# EAGLE design LCDShieldC144MVGI 1.0 (EAGLE 5.11)

## Sheet 1 of 2
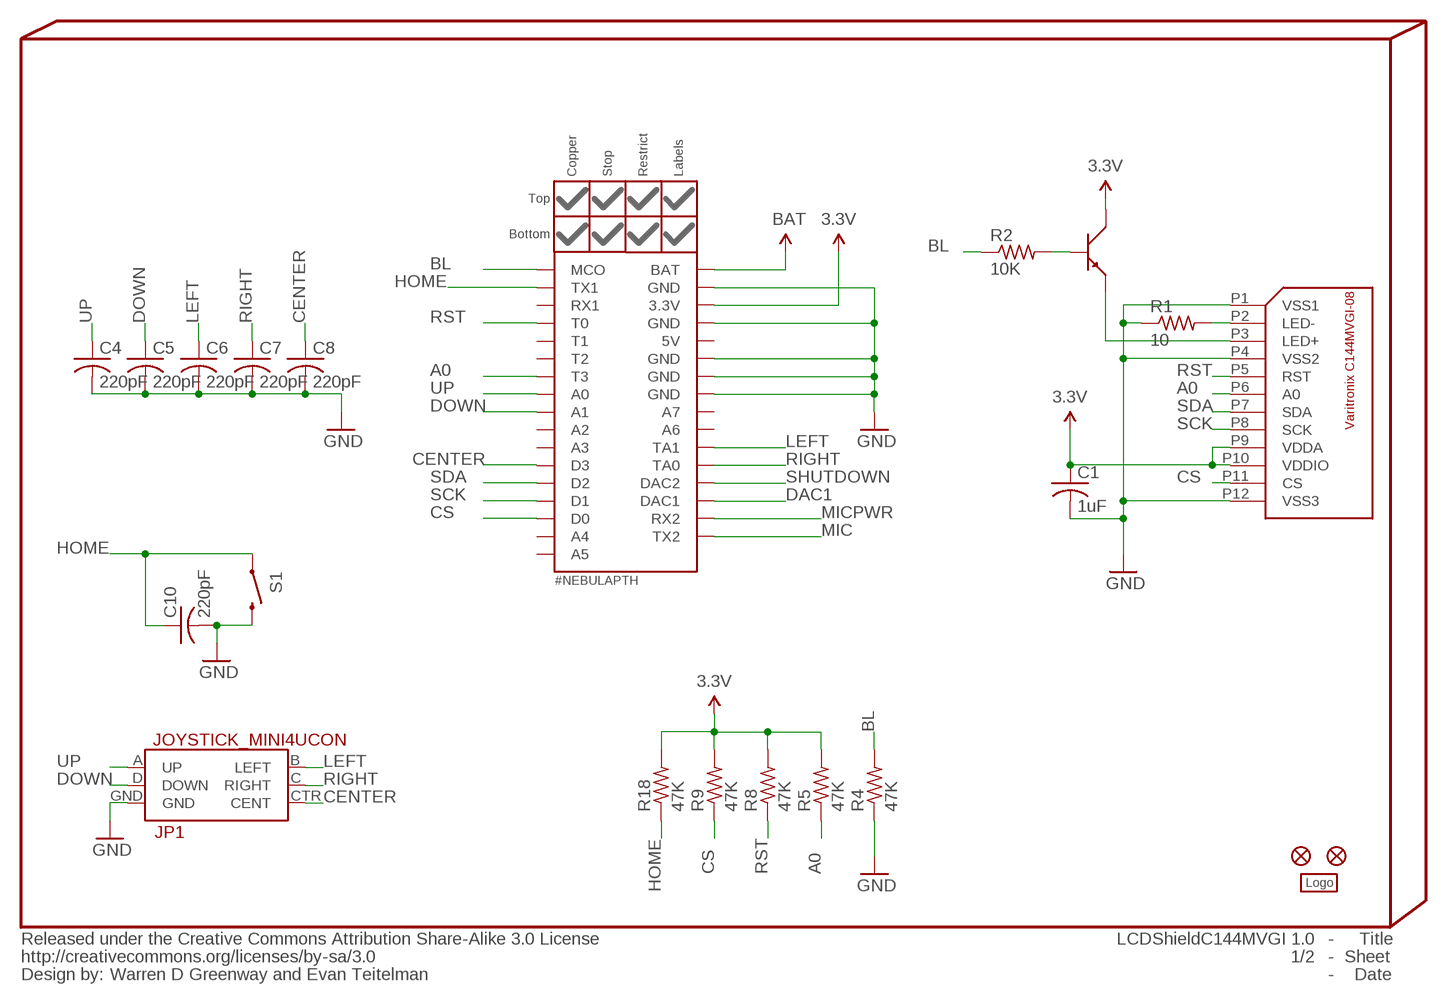
[diagram p0: schematic, sheet 1]

### Parts
C1  1uF  C-USC0402  [C0402]
C4  220pF  C-USC0402  [C0402]
C5  220pF  C-USC0402  [C0402]
C6  220pF  C-USC0402  [C0402]
C7  220pF  C-USC0402  [C0402]
C8  220pF  C-USC0402  [C0402]
C10  220pF  C-USC0402  [C0402]
INFO3  Warren D Greenway and Evan Teitelman  %CC-BY-SA  [%CC-BY-SA]
JP1  JOYSTICK_MINI4UCON  [JOYSTICK_MINI]
JP2  FIDUCIAL1X2.5  [FIDUCIAL-1X2.5]
JP3  FIDUCIAL1X2.5  [FIDUCIAL-1X2.5]
LOGO1  #PYGMYLOGOLARGE  [#PYGMYLOGO]
NEBULA1  #NEBULAPTH  [#NEBULA-PTH]
R1  10  R-US_R0805  [R0805]
R2  10K  R-US_R0402  [R0402]
R4  47K  R-US_R0402  [R0402]
R5  47K  R-US_R0402  [R0402]
R8  47K  R-US_R0402  [R0402]
R9  47K  R-US_R0402  [R0402]
R18  47K  R-US_R0402  [R0402]
S1  SWITCH-MOMENTARY-2SMD  [SPARKFUN_TACTILE_SWITCH_SMD]
U2  BIPOLAR-PMBT6428  [DUBLIB_SOT23]
U$1  VARITRONIX_COG-C144MVGI-08FOLDED  [VARITRONIX_COG-C144MVGI-08_FOLDED]

### Nets
3.3V: C1.1 NEBULA1.3.3V R5.2 R8.2 R9.2 R18.2 U2.3 U$1.P9(VDDA) U$1.P10(VDDIO) ; supply symbol labelled @3.3V ; also sheet 2
A0: NEBULA1.T3 R5.1 U$1.P6(A0)
BAT: NEBULA1.BAT ; supply symbol labelled @BAT ; also sheet 2
BL: NEBULA1.MCO R2.1 R4.2
CENTER: C8.1 JP1.CTR(CENT) NEBULA1.D3
CS: NEBULA1.D0 R9.1 U$1.P11(CS)
DAC1: NEBULA1.DAC1 ; also sheet 2
DOWN: C5.1 JP1.D(DOWN) NEBULA1.A1
GND: C1.2 C4.2 C5.2 C6.2 C7.2 C8.2 C10.2 JP1.GND NEBULA1.GND1(GND) NEBULA1.GND2(GND) NEBULA1.GND3(GND) NEBULA1.GND4(GND) NEBULA1.GND5(GND) R1.1 R4.1 S1.3 U$1.P1(VSS1) U$1.P4(VSS2) U$1.P12(VSS3) ; supply symbol labelled @GND ; also sheet 2
HOME: C10.1 NEBULA1.COM1_TX(TX1) R18.1 S1.1
LEFT: C6.1 JP1.B(LEFT) NEBULA1.TA1
MIC: NEBULA1.COM2_TX(TX2) ; also sheet 2
MICPWR: NEBULA1.COM2_RX(RX2) ; also sheet 2
N$5: R1.2 U$1.P2(LED-)
N$6: U2.2 U$1.P3(LED+)
N$7: R2.2 U2.1
RIGHT: C7.1 JP1.C(RIGHT) NEBULA1.TA0
RST: NEBULA1.T0 R8.1 U$1.P5(RST)
SCK: NEBULA1.D1 U$1.P8(SCK)
SDA: NEBULA1.D2 U$1.P7(SDA)
SHUTDOWN: NEBULA1.DAC2 ; also sheet 2
UP: C4.1 JP1.A(UP) NEBULA1.A0
Unconnected: NEBULA1.5V NEBULA1.A2 NEBULA1.A3 NEBULA1.A4 NEBULA1.A5 NEBULA1.A6 NEBULA1.A7 NEBULA1.COM1_RX(RX1) NEBULA1.T1 NEBULA1.T2

## Sheet 2 of 2
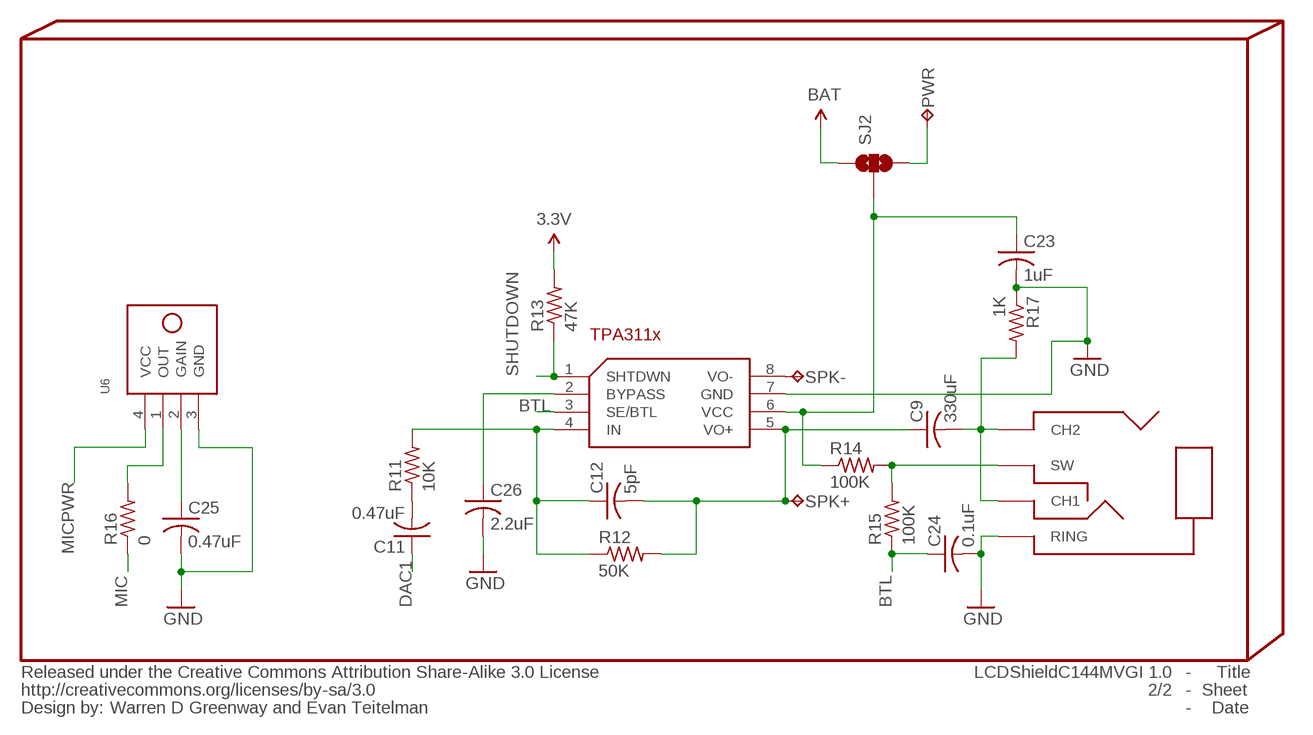
[diagram p1: schematic, sheet 2]

### Parts
C9  330uF  C-USC0402  [C0402]
C11  0.47uF  C-USC0402  [C0402]
C12  5pF  C-USC0402  [C0402]
C23  1uF  C-USC0402  [C0402]
C24  0.1uF  C-USC0402  [C0402]
C25  0.47uF  C-USC0402  [C0402]
C26  2.2uF  C-USC0402  [C0402]
PWR  TESTPAD_TPTESTPAD_PTH_STD  [TESTPAD_PTH_STD]
R11  10K  R-US_R0402  [R0402]
R12  50K  R-US_R0402  [R0402]
R13  47K  R-US_R0402  [R0402]
R14  100K  R-US_R0402  [R0402]
R15  100K  R-US_R0402  [R0402]
R16  0  R-US_R0402  [R0402]
R17  1K  R-US_R0402  [R0402]
SJ2  SOLDERJUMPER_2WAYS  [SJ_3]
SPK+  TESTPAD_TPTESTPAD_PTH_STD  [TESTPAD_PTH_STD]
SPK-  TESTPAD_TPTESTPAD_PTH_STD  [TESTPAD_PTH_STD]
U5  TPA311  [SO08]
U6  MIC_KNOWLES_SPM0408HE5H  [SPM0408HE5H]
U7  KOBICONN-161-4034-E-TOP  [KOBICONN-161-403X-E-TOP]

### Nets
3.3V: R13.2 ; supply symbol labelled @3.3V ; also sheet 1
BAT: SJ2.1 ; supply symbol labelled @BAT ; also sheet 1
BTL: C24.1 R15.1 U5.3(SE/BTL)
DAC1: C11.1 ; also sheet 1
GND: C23.2 C24.2 C25.2 C26.2 R17.1 U5.7(GND) U6.3(GND) U7.P$1(RING) ; supply symbol labelled @GND ; also sheet 1
MIC: R16.1 ; also sheet 1
MICPWR: U6.4(VCC) ; also sheet 1
N$8: R16.2 U6.1(OUT)
N$9: C12.1 R11.2 R12.1 U5.4(IN)
N$10: C23.1 R14.1 SJ2.2 U5.6(VCC)
N$17: PWR.P$1(TP) SJ2.3
N$18: C11.2 R11.1
N$19: C9.1 C12.2 R12.2 SPK+.P$1(TP) U5.5(VO+)
N$20: C9.2 R17.2 U7.P$2(CH1) U7.P$4(CH2)
N$21: C26.1 U5.2(BYPASS)
N$22: R14.2 R15.2 U7.P$3(SW)
N$23: SPK-.P$1(TP) U5.8(VO-)
N$24: C25.1 U6.2(GAIN)
SHUTDOWN: R13.1 U5.1(SHTDWN) ; also sheet 1

## Library data of the parts
C1 C4-C12 C23-C26 = rcl:C-US: CAPACITOR, American symbol
INFO3 = PygmyBoards:%CC-BY-SA: Creative Commons Attribution-ShareAlike License <http://creativecommons.org/licenses/by-sa/3.0/>
JP1 = SparkFun:JOYSTICK_MINI
JP2 JP3 = SparkFun:FIDUCIAL: Fiducial Alignment Points Various fiducial points for machine vision alignment.
LOGO1 = Pygmy:#PYGMYLOGO
NEBULA1 = PygmyBoards:#NEBULA: Nebula Board and Shield Footprint Pads This is the only absolutely required part for the footprint. The parts in "#NEBULA-PART" are merely aesthetic. A circular board outline should be .001" thick and 1.005" in diameter (Reference circle on the Document (48) layer provided).
PWR SPK+ SPK- = Pygmy:TESTPAD_TP: Test pad
R1 R2 R4 R5 R8 R9 R11-R18 = rcl:R-US_: RESISTOR, American symbol
S1 = Pygmy:SWITCH-MOMENTARY-2
SJ2 = Pygmy:SOLDERJUMPER_2WAY: Solder Jumper 2 way solder jumper
U2 = Pygmy:BIPOLAR-PMBT6428
U5 = Pygmy:TPA311
U6 = Pygmy:MIC_KNOWLES_SPM0408HE5H: Knowles Acoustics Amplified Microphone
U7 = Pygmy:KOBICONN-161-4034-E-TOP
U$1 = Pygmy:VARITRONIX_COG-C144MVGI-08

## Board
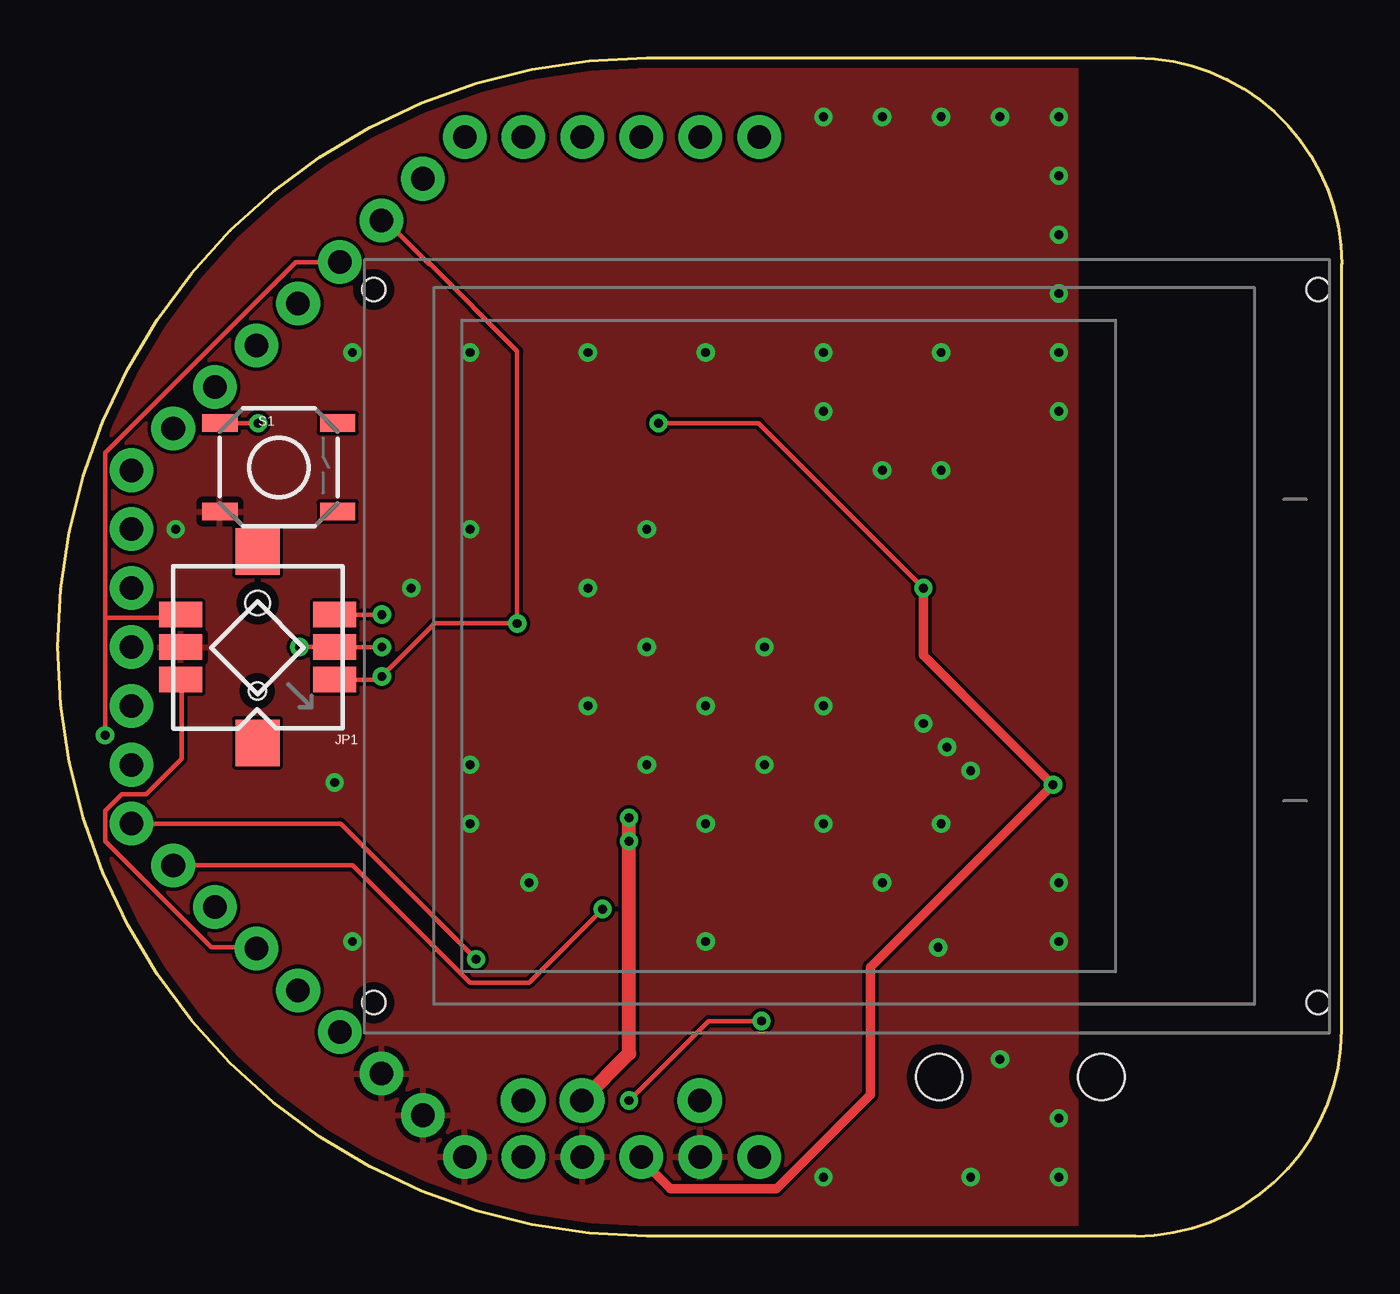
[diagram p2: board, top side]
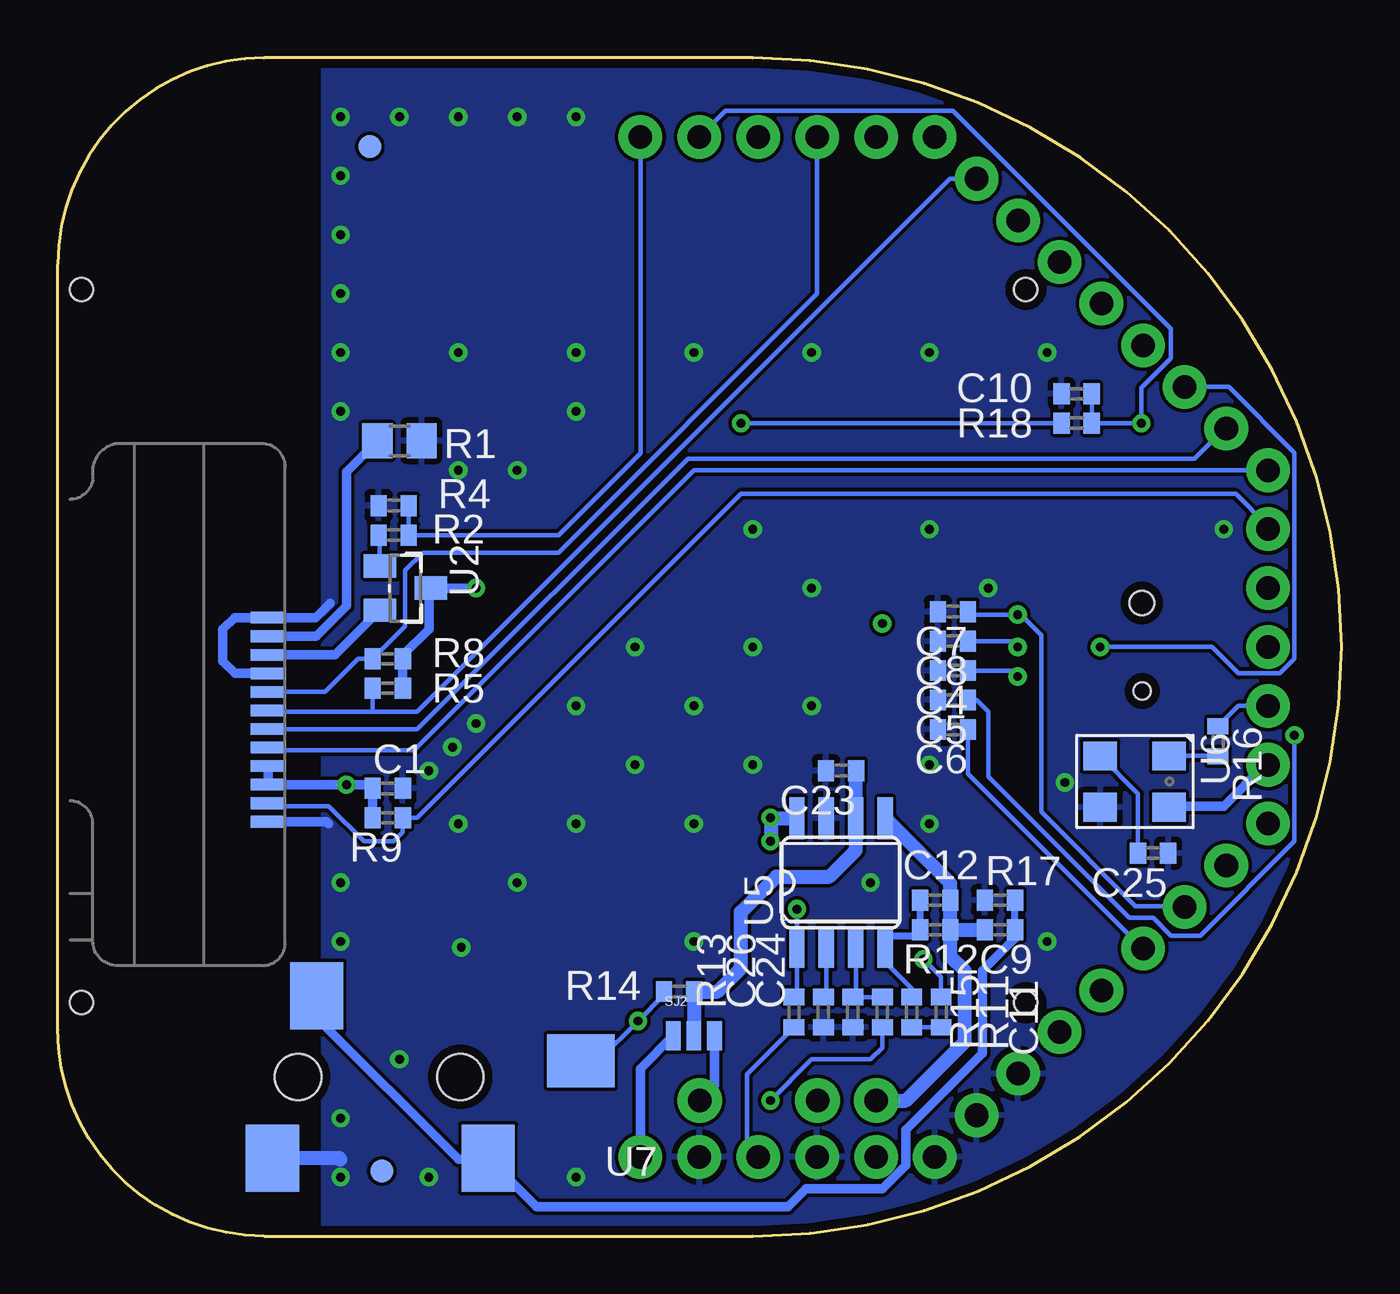
[diagram p3: board, bottom side, seen from below]

Size 55.37 x 50.8 mm. Coordinates in mm from the lower left corner, seen from the top.
Outline: 25.4,0 arc-180 25.4,50.8 46.48,50.8 arc-90 55.37,41.91 55.37,8.89 arc-90 46.48,0 25.4,0
Copper layers (1*16): Top 0.035mm / dielectric 1.5mm / Bottom 0.035mm
Design rules "PDX (Production)": minimum track width 6mil, minimum drill 15mil, track to track 6mil, track to pad 6mil, pad to pad 4mil, via to via 6mil, smd to smd 4mil, copper to edge 15mil, drill to drill 6mil, minimum pad ring 10mil, minimum via ring 8mil, stop-mask expansion 4mil, vias tented up to drill 25mil, thermal gap 10mil
bRestrict: area 0.5,22.1 to 1.8,30

### Footprints (pad centres in the part's own frame; a part is rotated, then mirrored left to right if it is on the bottom)
C0402 = smd 0.7 x 0.9: 1 -0.65,0; 2 0.65,0
JOYSTICK_MINI = smd 1.85 x 1.1: A 0,2.8; B 6.65,2.8; C 0,0; CTR 0,1.4; D 6.65,0; GND 6.65,1.4 | smd 1.9 x 2: NC 3.325,5.53; NC@0 3.33,-2.72 | hole 0.75: 3.34,3.295 | hole 1.05: 3.325,-0.5
FIDUCIAL-1X2.5 = smd 1 x 1: 1 0,0
#NEBULA-PTH = drill 1.016 pad 1.88 round: 3.3V -25.637,-47.388; 5V -30.716,-47.388; A0 -36.848,-7.004; A1 -38.645,-8.8; A2 -40.44,-10.596; A3 -42.237,-12.392; A4 -47.625,-22.86; A5 -47.625,-25.4; A6 -40.44,-40.204; A7 -38.645,-42; BAT -20.557,-47.388; COM1_RX -25.636,-3.412; COM1_TX -23.096,-3.412; COM2_RX -47.625,-30.48; COM2_TX -47.625,-27.94; D0 -47.625,-20.32; D1 -47.625,-17.78; D2 -45.829,-15.984; D3 -44.032,-14.188; DAC1 -47.625,-33.02; DAC2 -45.829,-34.816; GND1 -36.848,-43.796; GND2 -35.052,-45.592; GND3 -33.256,-47.388; GND4 -28.177,-47.388; GND5 -23.097,-47.388; MCO -20.556,-3.412; T0 -28.176,-3.412; T1 -30.716,-3.412; T2 -33.256,-3.412; T3 -35.052,-5.208; TA0 -44.032,-36.612; TA1 -42.237,-38.408
TESTPAD_PTH_STD = drill 1.016 pad 1.93 round: P$1 0,0
R0805 = smd 1.3 x 1.5: 1 -0.95,0; 2 0.95,0
R0402 = smd 0.7 x 0.9: 1 -0.65,0; 2 0.65,0
SPARKFUN_TACTILE_SWITCH_SMD = smd 1.524 x 0.762: 1 -2.54,1.905; 2 2.54,1.905; 3 -2.54,-1.905; 4 2.54,-1.905
SJ_3 = smd 0.635 x 1.27: 1 -0.889,0; 2 0,0; 3 0.889,0
DUBLIB_SOT23 = smd 1 x 1.4: 1 -0.95,-1.1; 2 0.95,-1.1; 3 0,1.1
SO08 = smd 0.66 x 1.8: 1 -1.905,-2.773; 2 -0.635,-2.773; 3 0.635,-2.773; 4 1.905,-2.773; 5 1.905,2.773; 6 0.635,2.773; 7 -0.635,2.773; 8 -1.905,2.773
SPM0408HE5H = smd 1.245 x 1.448: 1 -1.143,1.448; 2 -1.143,-1.524; 3 1.067,-1.524; 4 1.067,1.448
KOBICONN-161-403X-E-TOP = smd 2.3 x 2.9: P$1 -2.4,3.5; P$2 -11.7,3.5; P$4 -4.3,-3.5 | smd 2.9 x 2.3: P$3 -15.7,-0.7 | hole 2: -3.5,0; -10.5,0
VARITRONIX_COG-C144MVGI-08_FOLDED = smd 0.5 x 1.5 bottom: P1 17.9,8.55; P2 17.1,8.55; P3 16.3,8.55; P4 15.5,8.55; P5 14.7,8.55; P6 13.9,8.55; P7 13.1,8.55; P8 12.3,8.55; P9 11.5,8.55; P10 10.7,8.55; P11 9.9,8.55; P12 9.1,8.55 | hole 1: 1.3,0.5; 32.05,41.24; 1.3,41.24; 32.05,0.5

### Placement (x,y rotation side)
C1  41.15,19.3 0 bottom
C4  16.76,24.38 180 bottom
C5  16.76,23.11 180 bottom
C6  16.76,21.84 180 bottom
C7  16.76,26.92 180 bottom
C8  16.76,25.65 180 bottom
C9  14.73,13.21 0 bottom
C10  11.43,36.32 180 bottom
C11  17.27,9.65 270 bottom
C12  17.53,14.48 0 bottom
C23  21.59,20.07 180 bottom
C24  21.08,9.65 270 bottom
C25  8.13,16.51 0 bottom
C26  22.35,9.65 270 bottom
INFO3  0,-7.62 0 top  (outside the outline)
JP1  11.94,26.8 180 top
JP2  41.91,46.99 0 bottom
JP3  41.4,2.79 0 bottom
LOGO1  27.94,25.4 0 bottom
NEBULA1  50.8,50.8 0 top
PWR  27.69,5.84 0 top
R1  40.64,34.29 180 bottom
R2  40.89,30.23 180 bottom
R4  40.89,31.5 0 bottom
R5  41.15,23.62 0 bottom
R8  41.15,24.89 0 bottom
R9  41.15,18.03 180 bottom
R11  18.54,9.65 90 bottom
R12  17.53,13.21 0 bottom
R13  23.62,9.65 270 bottom
R14  28.57,10.54 180 bottom
R15  19.81,9.65 270 bottom
R16  5.33,21.34 270 bottom
R17  14.73,14.48 0 bottom
R18  11.43,35.05 180 bottom
S1  9.53,33.15 0 top
SJ2  27.94,8.64 0 bottom
SPK+  20.07,5.84 0 top
SPK-  22.61,5.84 0 top
U2  40.39,27.94 270 bottom
U5  21.59,15.24 0 bottom
U6  8.89,19.56 270 bottom
U7  48.51,6.86 180 bottom
U$1  54.86,8.76 90 top

### Tracks (layer width: path | path; a pad name or v marks a point on that pad's centre or on a via)
3.3V  (via drill 0.38)
  Top 0.203: v25.91,35.05 30.23,35.05 v37.34,27.94
  Top 0.406: v37.34,27.94 37.34,25.05 v42.93,19.46 35.05,11.59 35.05,6.1 30.99,2.03 26.42,2.03 25.16,3.29 NEBULA1.3.3V
  Bottom 0.203: v25.91,35.05 R18.2 | R13.2 25.65,6.97 25.65,4.06 25.16,3.57 NEBULA1.3.3V
  Bottom 0.406: U$1.P9 U$1.P10 v42.93,19.46 41.96,19.46 C1.1 R9.2 | R5.2 R8.2 40.5,25.03 39.37,26.16 39.37,27.86 U2.3 v37.34,27.94
A0
  Bottom 0.203: 41.78,22.61 39.88,22.61 16.89,45.59 NEBULA1.T3 | 41.78,22.61 46.26,22.61 U$1.P6 | R5.1 41.8,22.62 41.78,22.61
BAT
  Bottom 0.406: SJ2.1 30.24,7.22 NEBULA1.BAT
BL
  Bottom 0.203: R4.2 R2.1 33.78,30.23 30.24,33.76 NEBULA1.MCO
BTL
  Bottom 0.203: R15.1 C24.1 20.95,10.18 U5.3
CENTER  (via drill 0.38)
  Top 0.203: v13.97,25.4 JP1.CTR v10.41,25.4
  Bottom 0.203: v13.97,25.4 14.22,25.65 C8.1 | v10.41,25.4 5.59,25.4 4.45,24.26 2.67,24.26 2.03,24.89 2.03,33.78 4.86,36.61 NEBULA1.D3
CS
  Bottom 0.203: U$1.P11 46.19,18.54 43.69,18.54 42.16,17.02 40.89,17.02 40.5,17.41 R9.1 39.88,18.03 25.91,32 4.57,32 3.17,30.61 NEBULA1.D0
DAC1  (via drill 0.38)
  Top 0.203: v18.03,11.94 12.19,17.78 NEBULA1.DAC1
  Bottom 0.203: C11.1 17.27,11.18 v18.03,11.94
DOWN  (via drill 0.38)
  Top 0.203: v2.03,21.59 2.03,26.67 | 2.03,26.67 2.03,33.78 10.25,42 NEBULA1.A1 | JP1.D 5.21,26.8 5.08,26.67 2.03,26.67
  Bottom 0.203: C5.1 15.75,23.11 15.24,22.61 15.24,19.81 9.14,13.72 8.13,13.72 7.37,12.95 6.1,12.95 2.03,17.02 v2.03,21.59
GND  (via drill 0.38)
  Bottom 0.406: 43.64,27.28 44.25,26.66 U$1.P1 47.76,26.66 48.26,26.16 48.26,24.79 47.73,24.26 U$1.P4 | U$1.P12 43.77,17.86 43.69,17.78
  Bottom 0.61: U7.P$1 43.24,3.36 43.18,3.3
  other vias: 33.02,17.78 33.02,22.86 37.97,12.45 12.7,38.1 33.02,38.1 33.02,35.56 35.56,15.24 22.86,22.86 39.37,2.54 43.18,2.54 43.18,5.08 17.78,17.78 17.78,20.32 43.18,12.7 33.02,48.26 35.56,48.26 38.1,48.26 40.64,48.26 43.18,48.26 43.18,45.72 43.18,43.18 43.18,40.64 43.18,38.1 43.18,35.56 38.1,33.02 12.7,12.7 27.94,17.78 37.34,22.1 38.35,21.08 38.1,17.78 39.37,20.07 43.18,15.24 11.94,19.56 33.02,2.54 40.64,7.62 20.32,15.24 27.94,12.7 30.48,20.32 25.4,20.32 25.4,30.48 27.94,22.86 22.86,38.1 15.24,27.94 17.78,38.1 27.94,38.1 35.56,33.02 22.86,27.94 17.78,30.48 30.48,25.4 38.1,38.1 25.4,25.4 5.08,30.48
  pour Bottom: -5.08,56.39 43.94,56.39 43.94,-5.08 -5.08,-5.08
  pour Top: -1.78,52.83 43.94,52.83 43.94,-1.52 -1.78,-1.52
HOME  (via drill 0.38)
  Top 0.203: S1.1 v8.64,35.05
  Bottom 0.203: C10.1 R18.1 v8.64,35.05 8.64,36.58 7.37,37.85 7.37,39.12 16.76,48.51 26.58,48.51 NEBULA1.COM1_TX
LEFT
  Top 0.203: JP1.B 5.33,23.95 5.33,20.57 3.81,19.05 2.74,19.05 2.03,18.34 2.03,17.02 6.6,12.45 8.51,12.45 NEBULA1.TA1
  Bottom 0.203: C6.1 16.11,19.94 NEBULA1.TA1
MIC
  Bottom 0.203: R16.1 4.46,22.86 NEBULA1.COM2_TX
MICPWR
  Bottom 0.203: NEBULA1.COM2_RX 3.3,20.32
  Bottom 0.406: 3.3,20.32 5.08,18.54 7.39,18.54 U6.4
N$5
  Bottom 0.406: U$1.P2 44.24,25.86 42.93,27.18 42.93,32.95 R1.2
N$6
  Bottom 0.406: U$1.P3 43.41,25.06 U2.2
N$7
  Bottom 0.203: U2.1 41.49,30.17 R2.2
N$8
  Bottom 0.203: U6.1 5.35,20.7 R16.2
N$9
  Bottom 0.203: U5.4 19.68,11.81 18.54,10.67 R11.2
  Bottom 0.305: U5.4 19.68,12.83 19.56,12.95 18.43,12.95 R12.1 C12.1
N$10
  Bottom 0.406: R14.1 27.94,10.53 | U5.6 20.94,18.03
  Bottom 0.61: 27.94,10.53 SJ2.2 | U5.6 20.95,16.64 22.1,15.49 24.38,15.49 25.91,13.97 25.91,11.56 26.92,10.54 R14.1 | 20.94,18.03 C23.1
N$17
  Bottom 0.406: SJ2.3 27.05,6.48 PWR.P$1
N$18
  Bottom 0.203: C11.2 R11.1
N$19
  Bottom 0.61: R12.2 C12.2 16.88,15.2 U5.5 | R12.2 C9.1 | R12.2 16.88,12.05 16.26,11.43 16.26,8.38 18.8,5.84 SPK+.P$1
N$20
  Bottom 0.305: C9.2 R17.2
  Bottom 0.406: 44.21,9.42 38.1,3.3 36.87,3.3 | C9.2 14.08,12.84 15.49,11.43 15.49,7.87 18.8,4.57 18.8,3.05 19.81,2.03 23.11,2.03 23.88,1.27 34.73,1.27 U7.P$2
  Bottom 0.61: 44.21,9.42 U7.P$4 | U7.P$2 36.87,3.3
N$21
  Bottom 0.203: U5.2 22.23,10.18 C26.1
N$22  (via drill 0.38)
  Top 0.203: v24.64,5.84 28.07,9.27 v30.35,9.27
  Bottom 0.203: R14.2 29.23,10.4 v30.35,9.27 32.07,7.56 U7.P$3 | R15.2 19.81,8.13 20.32,7.62 22.86,7.62 v24.64,5.84
N$23  (via drill 0.38)
  Top 0.61: v24.64,18.03 24.64,7.87 SPK-.P$1
  Bottom 0.61: 24.62,18.01 U5.8 | v24.64,18.03 24.62,18.01 | 24.62,18.01 24.62,17.04 v24.64,17.02
N$24
  Bottom 0.203: C25.1 8.78,19.07 U6.2
RIGHT  (via drill 0.38)
  Top 0.203: v13.97,26.8 JP1.C
  Bottom 0.203: C7.1 15.99,26.8 v13.97,26.8 13.84,26.8 12.95,25.91 12.95,18.29 8.89,14.22 6.86,14.22 6.82,14.19 NEBULA1.TA0
RST
  Bottom 0.203: U$1.P5 43.85,23.46 42.42,24.89 R8.1 | R8.1 41.81,24.9 | R8.1 40.39,26.3 40.39,28.7 39.62,29.46 33.78,29.46 22.62,40.62 NEBULA1.T0
SCK
  Bottom 0.203: U$1.P8 46.21,20.95 40.01,20.95 27.94,33.02 NEBULA1.D1
SDA
  Bottom 0.203: U$1.P7 46.3,21.84 39.88,21.84 28.19,33.53 6.35,33.53 5.06,34.82 NEBULA1.D2
SHUTDOWN  (via drill 0.38)
  Top 0.203: v23.5,14.1 20.32,10.92 17.78,10.92 12.72,15.98 NEBULA1.DAC2
  Bottom 0.203: R13.1 23.5,10.18 U5.1 v23.5,14.1
UP  (via drill 0.38)
  Top 0.203: JP1.A 13.84,24 v13.97,24.13 16.26,26.42 v19.81,26.42 19.81,38.15 16,41.96 16,41.91 14.35,43.56 | 14.35,43.56 14.12,43.8 | NEBULA1.A0 14.19,43.56 14.35,43.56
  Bottom 0.203: v13.97,24.13 14.22,24.38 C4.1

### Text on the board
bTest: Pygmy Nebula LCD Shield V1.0 | Design By: Warren D Grreenway | And Evan Teitelman | For use with Varitronix COG-C144MVGI-08
Document: Pygmy LCD Shield | Version 1.0 | Standard Grid: 50mil | Routing Grids: 8mil / 4mil
_tsilk: SPK+ | SPK- | SPWR